# Altium project stm32f030f4_heat_gun.PrjPcb
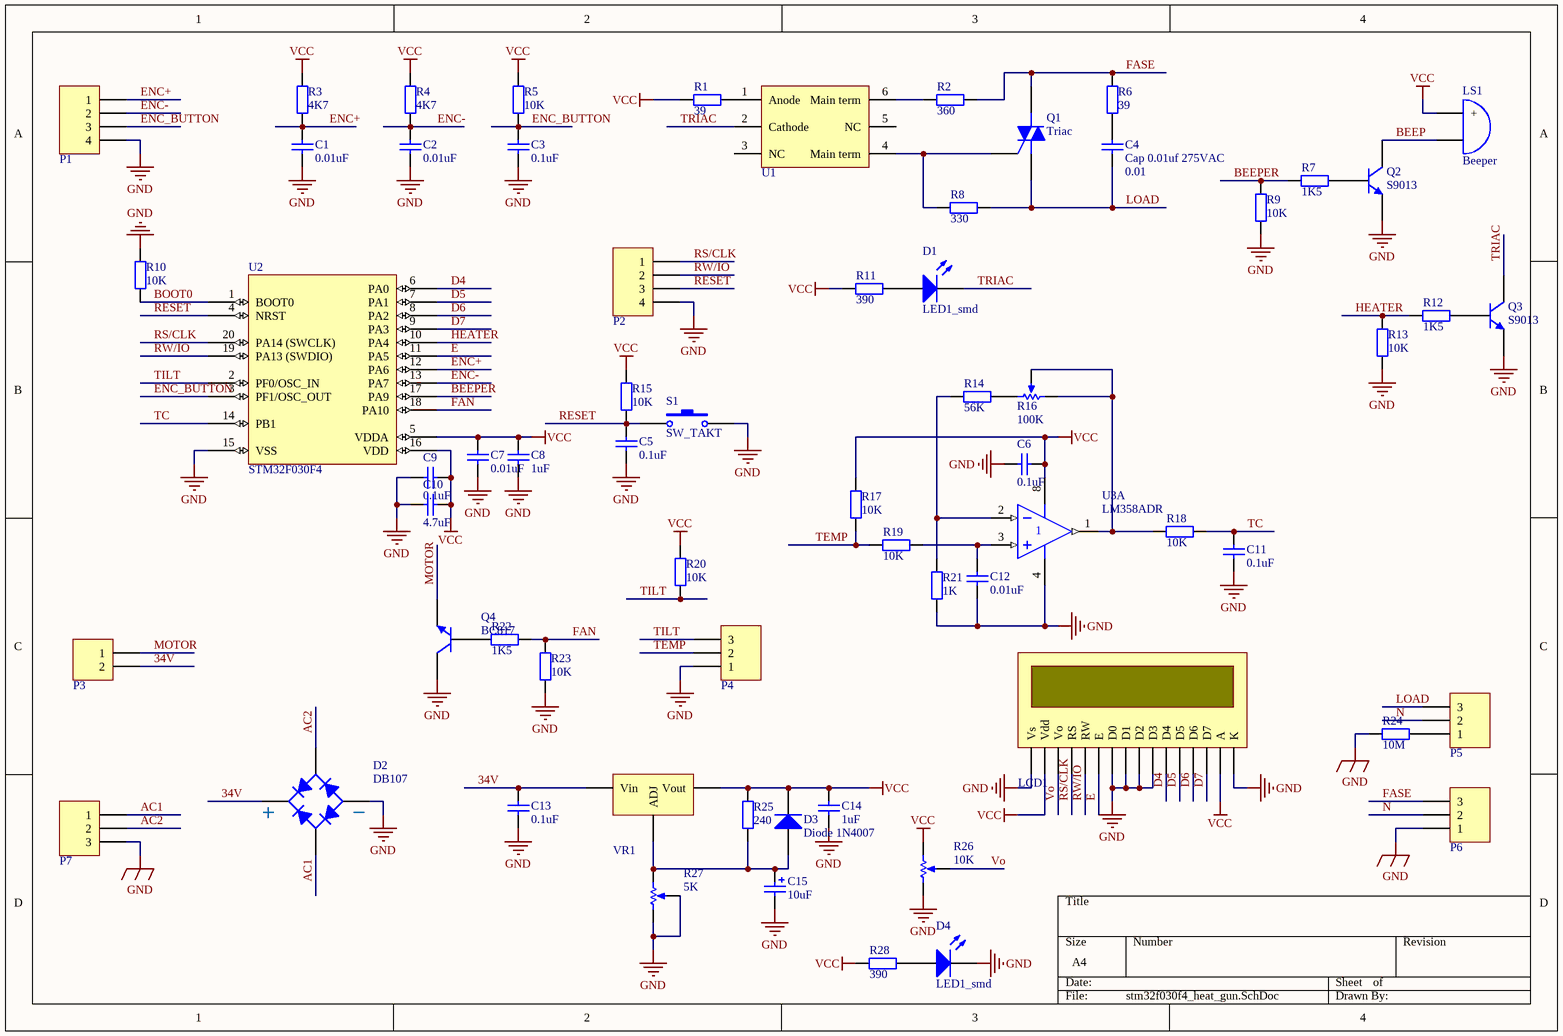
[diagram p0: stm32f030f4_heat_gun.SchDoc]
1 sheet, 65 parts. Net scope: global (net labels, ports and power ports of the same name join across sheets).

## Sheet stm32f030f4_heat_gun.SchDoc
size A4

### Parts
C1  value 0.01uF  [0805_C]  (hidden comment: Cap 0.01uf)
C2  value 0.01uF  [0805_C]  (hidden comment: Cap 0.01uf)
C3  value 0.1uF  [0805_C]  (hidden comment: Cap 0.1uf)
C4  Cap 0.01uf 275VAC  value 0.01  [CAPR1000-500X1300X1100]
C5  value 0.1uF  [0805_C]  (hidden comment: Cap 0.1uf)
C6  value 0.1uF  [0805_C]  (hidden comment: Cap 0.1uf)
C7  value 0.01uF  [0805_C]  (hidden comment: Cap 0.01uf)
C8  value 1uF  [0805_C]  (hidden comment: Cap 1uf)
C9  value 0.1uF  [0805_C]  (hidden comment: Cap 0.1uf)
C10  value 4.7uF  [1206_C]  (hidden comment: Cap 4.7uf)
C11  value 0.1uF  [0805_C]  (hidden comment: Cap 0.1uf)
C12  value 0.01uF  [0805_C]  (hidden comment: Cap 0.01uf)
C13  value 0.1uF  [1206_C]  (hidden comment: Cap 0.1uf)
C14  value 1uF  [1206_C]  (hidden comment: Cap 1uf)
C15  value 10uF  [CAPPRB508-450X850]  (hidden comment: Cap 10uf 16v tantalum)
D1  LED1_smd  [0805_R]
D2  DB107  [DIP6-300_4]
D3  Diode 1N4007  [DIOM5326X230N]
D4  LED1_smd  [0805_R]
LCD1  LCD1602  [LCD1602]  (value not drawn)
LS1  Beeper  [Beeper]
P1  Pin header 4  [Pin_header_4P_2.54_M]  (value not drawn)
P2  Pin header 4  [Pin_header_4P_2.54_M]  (value not drawn)
P3  Pin header 2  [PIN_HEADER_2_5.08]  (value not drawn)
P4  Pin header 3  [3P_5.08_G]  (value not drawn)
P5  Pin header 3  [3P_5.08_G]  (value not drawn)
P6  Pin header 3  [3P_5.08_G]  (value not drawn)
P7  Pin header 3  [3P_5.08_G]  (value not drawn)
Q1  Triac  [TO-220-v]
Q2  S9013  [SOT23]
Q3  S9013  [SOT23]
Q4  BC817  [SOT23]
R1  value 39  [1206_R]  (hidden comment: Res 39)
R2  value 360  [2512_S]  (hidden comment: Res 360)
R3  value 4K7  [0805_R]  (hidden comment: Res 4K7)
R4  value 4K7  [0805_R]  (hidden comment: Res 4K7)
R5  value 10K  [0805_R]  (hidden comment: Res 10K)
R6  value 39  [2512_S]  (hidden comment: Res 39)
R7  value 1K5  [0805_R]  (hidden comment: Res 1K5)
R8  value 330  [2512_S]  (hidden comment: Res 330)
R9  value 10K  [0805_R]  (hidden comment: Res 10K)
R10  value 10K  [0805_R]  (hidden comment: Res 10K)
R11  value 390  [0805_R]  (hidden comment: Res 390)
R12  value 1K5  [0805_R]  (hidden comment: Res 1K5)
R13  value 10K  [0805_R]  (hidden comment: Res 10K)
R14  value 56K  [1206_R]  (hidden comment: Res 56K)
R15  value 10K  [0805_R]  (hidden comment: Res 10K)
R16  value 100K  [TRIM_BOURNS_3266W]  (hidden comment: RPot_100k)
R17  value 10K  [0805_R]  (hidden comment: Res 10K)
R18  value 10K  [0805_R]  (hidden comment: Res 10K)
R19  value 10K  [0805_R]  (hidden comment: Res 10K)
R20  value 10K  [0805_R]  (hidden comment: Res 10K)
R21  value 1K  [1206_R]  (hidden comment: Res 1K)
R22  value 1K5  [0805_R]  (hidden comment: Res 1K5)
R23  value 10K  [0805_R]  (hidden comment: Res 10K)
R24  value 10M  [1206_R]  (hidden comment: Res 10M)
R25  value 240  [0805_R]  (hidden comment: Res 240)
R26  value 10K  [TRIM_BOURNS_3266W]  (hidden comment: RPot_10k)
R27  value 5K  [TRIM_BOURNS_3266W]  (hidden comment: RPot 5k)
R28  value 390  [0805_R]  (hidden comment: Res 390)
S1  SW_TAKT  [TAKT-KEY]
U1  MOC3041  [DIP6-300]  (value not drawn)
U2  STM32F030F4  [SOP65P640X120-20N]
U3  LM358ADR  [SOIC127_8]  (part A of 2)
VR1  LM317  [TO-220-v]  (value not drawn)

### Nets
GND: C1.1 C2.1 C3.1 C5.1 C6.2 C7.1 C8.1 C9.2 C10.1 C11.2 C12.1 C13.1 C14.1 C15.2 D2.2(K) D4.2(K) LCD1.1(Vs) LCD1.7(D0) LCD1.8(D1) LCD1.9(D2) LCD1.10(D3) LCD1.16(K) P1.4 P2.4 P4.1 P6.1 P7.3 Q2.2(E) Q3.2(E) Q4.3(C) R9.1 R10.2 R13.1 R21.1 R23.1 R24.1 R26.1(TOP) R27.1(TOP) R27.2(TAP) S1.2 U2.15(VSS) U3.4(V-)
VCC: C6.1 C7.2 C8.2 C9.1 C10.2 C14.2 D3.2(K) LCD1.2(Vdd) LCD1.15(A) LS1.1(+) R1.1 R3.2 R4.2 R5.2 R11.2 R15.2 R17.1 R20.2 R25.2 R26.3(BOT) R28.1 U2.5(VDDA) U2.16(VDD) U3.8(V+) VR1.2(Vout)
34V: C13.2 D2.1(A) P3.2 VR1.3(Vin)
AC1: D2.3(AC) P7.1
AC2: D2.4(AC) P7.2
BEEP: LS1.2(B) Q2.3(C)
BEEPER: R7.1 R9.2 U2.17(PA9)
BOOT0: R10.1 U2.1(BOOT0)
D4: LCD1.11(D4) U2.6(PA0)
D5: LCD1.12(D5) U2.7(PA1)
D6: LCD1.13(D6) U2.8(PA2)
D7: LCD1.14(D7) U2.9(PA3)
E: LCD1.6(E) U2.11(PA5)
ENC+: C1.2 P1.1 R3.1 U2.12(PA6)
ENC-: C2.2 P1.2 R4.1 U2.13(PA7)
ENC_BUTTON: C3.2 P1.3 R5.1 U2.3(PF1/OSC_OUT)
FAN: R22.2 R23.2 U2.18(PA10)
FASE: P6.3 Q1.2(A2) R2.2 R6.2
HEATER: R12.1 R13.2 U2.10(PA4)
LOAD: C4.1 P5.3 Q1.1(A1) R8.2
MOTOR: P3.1 Q4.2(E)
N: P5.2 P6.2
RESET: C5.2 P2.3 R15.1 S1.1 U2.4(NRST)
RS/CLK: LCD1.4(RS) P2.1 U2.20(PA14_(SWCLK))
RW/IO: LCD1.5(RW) P2.2 U2.19(PA13_(SWDIO))
TC: C11.1 R18.1 U2.14(PB1)
TEMP: P4.2 R17.2 R19.2
TILT: P4.3 R20.1 U2.2(PF0/OSC_IN)
TRIAC: D1.2(K) Q3.3(C) U1.2(Cathode)
Vo: LCD1.3(Vo) R26.2(TAP)
NetC4_2: C4.2 R6.1
NetC12_2: C12.2 R19.1 U3.3(IN+)
NetC15_1: C15.1 D3.1(A) R25.1 R27.3(BOT) VR1.1(ADJ)
NetD1_1: D1.1(A) R11.1
NetD4_1: D4.1(A) R28.2
NetP5_1: P5.1 R24.2
NetQ1_3: Q1.3(G) R8.1 U1.4(Main_term)
NetQ2_1: Q2.1(B) R7.2
NetQ3_1: Q3.1(B) R12.2
NetQ4_1: Q4.1(B) R22.1
NetR1_2: R1.2 U1.1(Anode)
NetR2_1: R2.1 U1.6(Main_term)
NetR14_1: R14.1 R21.2 U3.2(IN-)
NetR14_2: R14.2 R16.3(BOT)
NetR16_1: R16.1(TOP) R16.2(TAP) R18.2 U3.1(OUT)

Not connected (* = marked no-connect by the designer): U1 3(NC) 5(NC)

### Library data of the parts
C4 = Cap 0.01uf 275VAC: Capacitor; Published: 8-Jun-2000; LatestRevisionDate: 17-Jul-2002; LatestRevisionNote: Re-released for DXP Platform.; PackageReference: RAD-0.3; Publisher: Altium Limited; PackageDescription: Radial Cap, Thru-Hole; 2 Leads; 0.3 in Pin Spacing
C15 = Cap 10uf 16v tantalum: Polarized Capacitor (Surface Mount); Published: 8-Jun-2000; LatestRevisionDate: 29-May-2009; LatestRevisionNote: IPC-7351 Footprint Added.; PackageReference: C0805; Publisher: Altium Limited; PackageDescription: Chip Capacitor
D1 D4 = LED1_smd: Typical RED GaAs LED; Published: 8-Jun-2000; LatestRevisionDate: 08-Jul-2005; LatestRevisionNote: Mech Layer 1 removed.; PackageReference: LED-1; Publisher: Altium Limited; PackageDescription: LED; 2 Leads
D2 = DB107: Full Wave Diode Bridge; Published: 8-Jun-2000; LatestRevisionDate: 29-May-2009; LatestRevisionNote: Sch pins A & K swapped.; DatasheetVersion: E2732B; PackageReference: D-38; Publisher: Altium Limited; PackageDescription: Bridge Rectifier; 4 Terminals; Body 9.4 x 9.4 mm (typ); Pitch 5.08 mm
D3 = Diode 1N4007: 1 Amp General Purpose Rectifier; Published: 8-Jun-2000; LatestRevisionDate: 17-Jul-2002; LatestRevisionNote: Re-released for DXP Platform.; DatasheetVersion: 1998; PackageVersion: Aug-1999; PackageReference: DO-41; Publisher: Altium Limited; PackageDescription: Diode, Axial; Body 5.2 x 2.7 mm (LxDia. max), Lead Dia. 0.86 mm (max); Code_JEDEC: DO-204-AL; ComponentLink1Description: Manufacturer Link; ComponentLink1URL: http://www.fairchildsemi.com/; ComponentLink2Description: Datasheet; ComponentLink2URL: http://www.fairchildsemi.com/ds/1N%2F1N4001.pdf
LCD1 = LCD1602: Display; Published: 24-Mar-1999; LatestRevisionDate: 29-May-2009; LatestRevisionNote: IPC-7351 Footprint Added.; PackageReference: D2PAK; Publisher: Altium Limited; PackageDescription: 3-Pin Transistor Outline Package 2.54 mm Pitch, 15.1 mm Lead Span
LS1 = Beeper: Electrical Bell; Published: 24-Mar-1999; LatestRevisionDate: 17-Jul-2002; LatestRevisionNote: Re-released for DXP Platform.; PackageReference: PIN2; Publisher: Altium Limited
Q1 = Triac: Silicon Bidirectional Triode Thyristor; Note: Pin 2 is electrically connected to Pin 4 (TAB); Published: 29-Sep-2000; LatestRevisionDate: 17-Jul-2002; LatestRevisionNote: Re-released for DXP Platform.; DatasheetVersion: 1999; PackageReference: 369-03; Publisher: Altium Limited; PackageDescription: TO, Thru-Hole, Vertical, Heatsink Mounted; 3 In-Line Leads; Pitch 2.28 mm; ComponentLink1Description: Manufacturer Link; ComponentLink1URL: http://www.motorola.com/
Q2 Q3 = S9013: NPN transistor; Published: 8-Jun-2000; LatestRevisionDate: 15-Jan-2003; LatestRevisionNote: PCB Footprint 'BCY-W3/D4.7' replaced; DatasheetVersion: 1997; PackageVersion: Sep-1998; PackageReference: TO-92A; Publisher: Altium Limited; PackageDescription: TO, Flat Index; 3 In-Line, Axial Leads; Body Dia. 4.5mm; Leads 0.51 x 0.48 mm (max); ComponentLink1Description: Manufacturer Link; ComponentLink1URL: http://www.fairchildsemi.com/; ComponentLink2Description: Datasheet; ComponentLink2URL: http://www.fairchildsemi.com/ds/2N%2F2N3904.pdf
Q4 = BC817: NPN Bipolar Transistor; Published: 8-Jun-2000; LatestRevisionDate: 17-Jul-2002; LatestRevisionNote: Re-released for DXP Platform.; PackageReference: TO-226-AA; Publisher: Altium Limited; PackageDescription: TO, Flat Index; 3 In-Line, Axial Leads; Body Dia. 4.8mm; Leads 0.55 x 0.51 mm (max); Code_JEDEC: TO-226-AA
R1 R6 = Res 39: Resistor; Published: 8-Jun-2000; LatestRevisionDate: 17-Jul-2002; LatestRevisionNote: Re-released for DXP Platform.; PackageReference: AXIAL-0.4; Publisher: Altium Limited; PackageDescription: Axial Device, Thru-Hole; 2 Leads; 0.4 in Pin Spacing
R2 = Res 360: Resistor; Published: 8-Jun-2000; LatestRevisionDate: 17-Jul-2002; LatestRevisionNote: Re-released for DXP Platform.; PackageReference: AXIAL-0.4; Publisher: Altium Limited; PackageDescription: Axial Device, Thru-Hole; 2 Leads; 0.4 in Pin Spacing
R3 R4 = Res 4K7: Resistor; Published: 8-Jun-2000; LatestRevisionDate: 17-Jul-2002; LatestRevisionNote: Re-released for DXP Platform.; PackageReference: AXIAL-0.4; Publisher: Altium Limited; PackageDescription: Axial Device, Thru-Hole; 2 Leads; 0.4 in Pin Spacing
R5 R9 R10 R13 R15 R17-R20 R23 = Res 10K: Resistor; Published: 8-Jun-2000; LatestRevisionDate: 17-Jul-2002; LatestRevisionNote: Re-released for DXP Platform.; PackageReference: AXIAL-0.4; Publisher: Altium Limited; PackageDescription: Axial Device, Thru-Hole; 2 Leads; 0.4 in Pin Spacing
R7 R12 R22 = Res 1K5: Resistor; Published: 8-Jun-2000; LatestRevisionDate: 17-Jul-2002; LatestRevisionNote: Re-released for DXP Platform.; PackageReference: AXIAL-0.4; Publisher: Altium Limited; PackageDescription: Axial Device, Thru-Hole; 2 Leads; 0.4 in Pin Spacing
R8 = Res 330: Resistor; Published: 8-Jun-2000; LatestRevisionDate: 17-Jul-2002; LatestRevisionNote: Re-released for DXP Platform.; PackageReference: AXIAL-0.4; Publisher: Altium Limited; PackageDescription: Axial Device, Thru-Hole; 2 Leads; 0.4 in Pin Spacing
R11 R28 = Res 390: Resistor; Published: 8-Jun-2000; LatestRevisionDate: 17-Jul-2002; LatestRevisionNote: Re-released for DXP Platform.; PackageReference: AXIAL-0.4; Publisher: Altium Limited; PackageDescription: Axial Device, Thru-Hole; 2 Leads; 0.4 in Pin Spacing
R14 = Res 56K: Resistor; Published: 8-Jun-2000; LatestRevisionDate: 17-Jul-2002; LatestRevisionNote: Re-released for DXP Platform.; PackageReference: AXIAL-0.4; Publisher: Altium Limited; PackageDescription: Axial Device, Thru-Hole; 2 Leads; 0.4 in Pin Spacing
R16 = RPot_100k: Potentiometer; Sim Note: Enter the Resistance value and the set point into parameter fields.; Set Position: 0.5; Published: 8-Jun-2000; LatestRevisionDate: 17-Jul-2002; LatestRevisionNote: Re-released for DXP Platform.; PackageReference: VR5; Publisher: Altium Limited; PackageDescription: Variable Resistor, Thru-Hole; 3 Leads
R21 = Res 1K: Resistor; Published: 8-Jun-2000; LatestRevisionDate: 17-Jul-2002; LatestRevisionNote: Re-released for DXP Platform.; PackageReference: AXIAL-0.4; Publisher: Altium Limited; PackageDescription: Axial Device, Thru-Hole; 2 Leads; 0.4 in Pin Spacing
R24 = Res 10M: Resistor; Published: 8-Jun-2000; LatestRevisionDate: 17-Jul-2002; LatestRevisionNote: Re-released for DXP Platform.; PackageReference: AXIAL-0.4; Publisher: Altium Limited; PackageDescription: Axial Device, Thru-Hole; 2 Leads; 0.4 in Pin Spacing
R25 = Res 240: Resistor; Published: 8-Jun-2000; LatestRevisionDate: 17-Jul-2002; LatestRevisionNote: Re-released for DXP Platform.; PackageReference: AXIAL-0.4; Publisher: Altium Limited; PackageDescription: Axial Device, Thru-Hole; 2 Leads; 0.4 in Pin Spacing
R26 = RPot_10k: Potentiometer; Sim Note: Enter the Resistance value and the set point into parameter fields.; Set Position: 0.5; Published: 8-Jun-2000; LatestRevisionDate: 17-Jul-2002; LatestRevisionNote: Re-released for DXP Platform.; PackageReference: VR5; Publisher: Altium Limited; PackageDescription: Variable Resistor, Thru-Hole; 3 Leads
R27 = RPot 5k: Potentiometer; Sim Note: Enter the Resistance value and the set point into parameter fields.; Set Position: 0.5; Published: 8-Jun-2000; LatestRevisionDate: 17-Jul-2002; LatestRevisionNote: Re-released for DXP Platform.; PackageReference: VR5; Publisher: Altium Limited; PackageDescription: Variable Resistor, Thru-Hole; 3 Leads
U1 = MOC3041: MOC; Published: 8-Jun-2000; LatestRevisionDate: 29-May-2009; LatestRevisionNote: IPC-7351 Footprint Added.; PackageVersion: May-1999; PackageReference: DB008; Publisher: Altium Limited; PackageDescription: 8-Pin Plastic Small Outline Package 0.65 mm Pitch; Code_JEDEC: MO-150-AA; Code_IPC: SOP65P780-8
U3 = LM358ADR: Dual Operational Amplifier; Published: 15-Apr-2002; LatestRevisionDate: 13-Apr-2006; LatestRevisionNote: IPC-7351 Footprint Added.; DatasheetVersion: Aug-1988; PackageVersion: Jan-1998; PackageReference: D008; Publisher: Altium Limited; PackageDescription: 8-Pin Small Outline Integrated Circuit 1.27 mm Pitch; Code_IPC: SOIC127P600-8; ComponentLink1Description: Manufacturer Link; ComponentLink1URL: http://www.ti.com/; ComponentLink2Description: Datasheet; ComponentLink2URL: http://www-s.ti.com/sc/ds/lm358.pdf
VR1 = LM317: Voltage Regulator; Published: 24-Mar-1999; LatestRevisionDate: 29-May-2009; LatestRevisionNote: IPC-7351 Footprint Added.; PackageReference: D2PAK; Publisher: Altium Limited; PackageDescription: 3-Pin Transistor Outline Package 2.54 mm Pitch, 15.1 mm Lead Span
C1 C2 C7 C12 = Cap 0.01uf: Published: 8-Jun-2000; LatestRevisionDate: 17-Jul-2002; LatestRevisionNote: Re-released for DXP Platform.; PackageReference: RB7.6-15; Publisher: Altium Limited; PackageDescription: Polarized Capacitor (Radial); 2 Leads
C3 C5 C6 C9 C11 C13 = Cap 0.1uf: Published: 8-Jun-2000; LatestRevisionDate: 17-Jul-2002; LatestRevisionNote: Re-released for DXP Platform.; PackageReference: RB7.6-15; Publisher: Altium Limited; PackageDescription: Polarized Capacitor (Radial); 2 Leads
C8 C14 = Cap 1uf: Published: 8-Jun-2000; LatestRevisionDate: 17-Jul-2002; LatestRevisionNote: Re-released for DXP Platform.; PackageReference: RB7.6-15; Publisher: Altium Limited; PackageDescription: Polarized Capacitor (Radial); 2 Leads
C10 = Cap 4.7uf: Published: 8-Jun-2000; LatestRevisionDate: 17-Jul-2002; LatestRevisionNote: Re-released for DXP Platform.; PackageReference: RB7.6-15; Publisher: Altium Limited; PackageDescription: Polarized Capacitor (Radial); 2 Leads
P1 P2 = Pin header 4: Published: 24-Mar-1999; LatestRevisionDate: 29-May-2009; LatestRevisionNote: IPC-7351 Footprint Added.; PackageReference: D2PAK; Publisher: Altium Limited; PackageDescription: 3-Pin Transistor Outline Package 2.54 mm Pitch, 15.1 mm Lead Span
P3 = Pin header 2: Published: 24-Mar-1999; LatestRevisionDate: 29-May-2009; LatestRevisionNote: IPC-7351 Footprint Added.; PackageReference: D2PAK; Publisher: Altium Limited; PackageDescription: 3-Pin Transistor Outline Package 2.54 mm Pitch, 15.1 mm Lead Span
P4-P7 = Pin header 3: Published: 24-Mar-1999; LatestRevisionDate: 29-May-2009; LatestRevisionNote: IPC-7351 Footprint Added.; PackageReference: D2PAK; Publisher: Altium Limited; PackageDescription: 3-Pin Transistor Outline Package 2.54 mm Pitch, 15.1 mm Lead Span